# Altium schematic sheet Sheet2.SchDoc
size A4; SheetNumber: 2; SheetTotal: 2
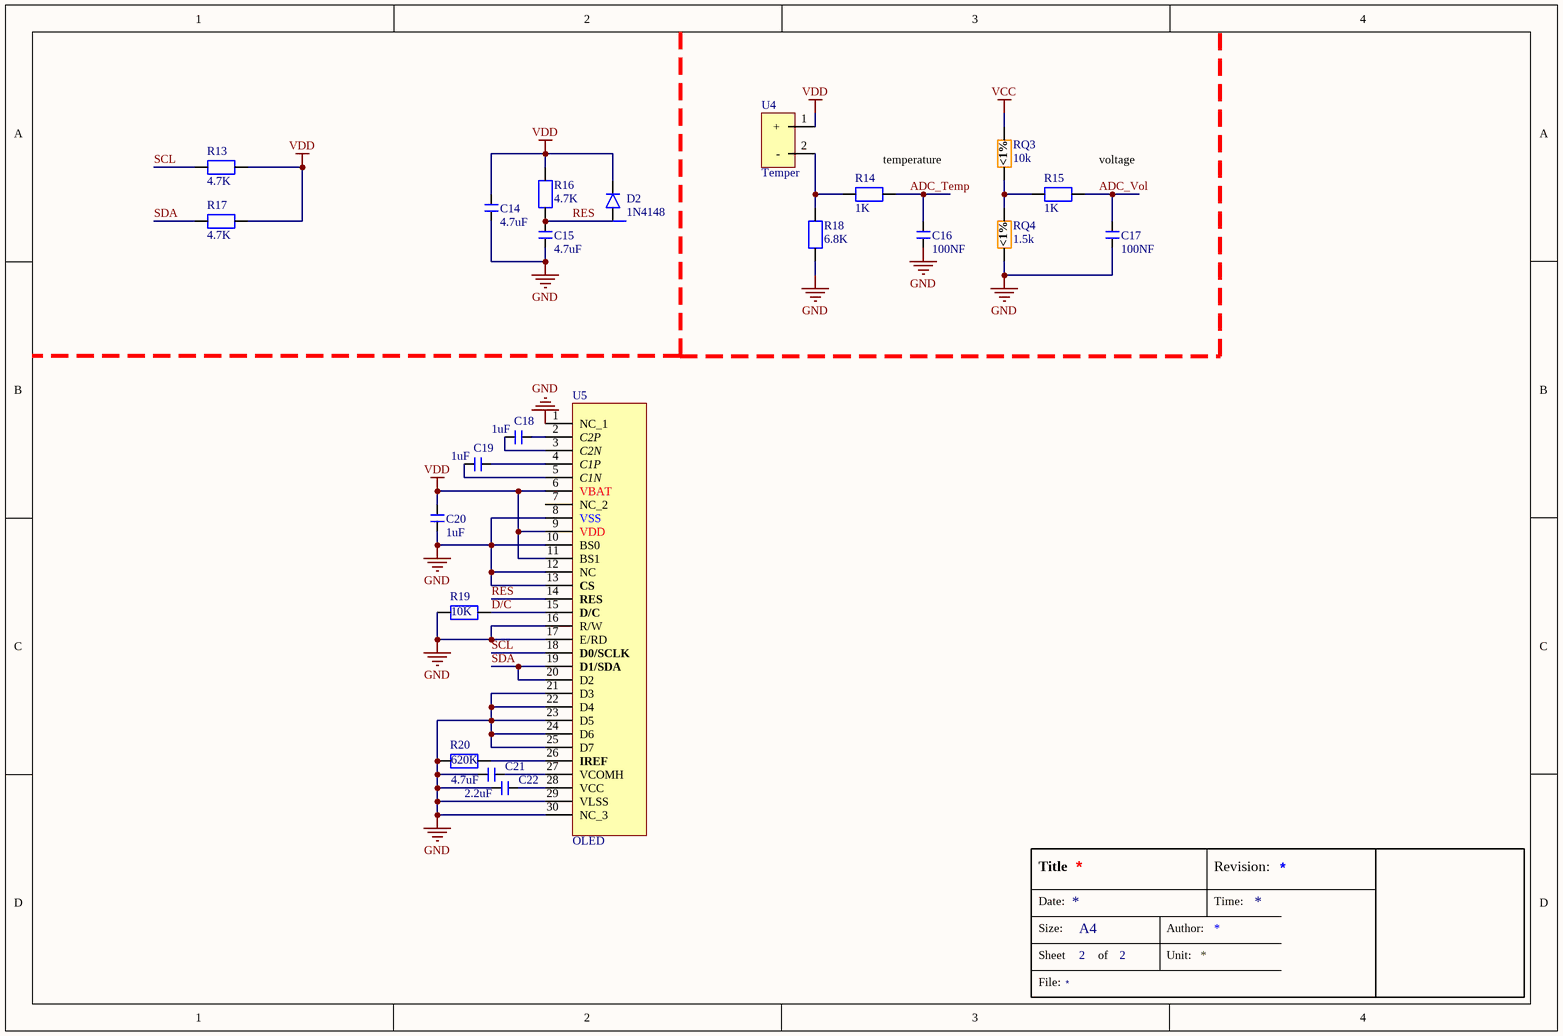
[diagram p0: Sheet2.SchDoc]

## Parts
C14  4.7uF  [CAP_0603]
C15  4.7uF  [CAP_0603]
C16  100NF  [CAP_0603]
C17  100NF  [CAP_0603]
C18  1uF  [CAP_0603]
C19  1uF  [CAP_0603]
C20  1uF  [CAP_0603]
C21  4.7uF  [CAP_0603]
C22  2.2uF  [CAP_0603]
D2  1N4148  [DIODE_SOD123]
R13  4.7K  [RESC_0603_2]
R14  1K  [RESC_0603_2]
R15  1K  [RESC_0603_2]
R16  4.7K  [RESC_0603_2]
R17  4.7K  [RESC_0603_2]
R18  6.8K  [RESC_0603_2]
R19  10K  [RESC_0603_2]
R20  620K  [RESC_0603_2]
RQ3  10k  [RESC_0603_2]
RQ4  1.5k  [RESC_0603_2]
U4  Temper  [RESC_0603_1]
U5  OLED  [OLED_0.96]

## Nets
GND: C14.1 C15.1 C16.1 C17.1 C20.2 C21.2 C22.2 R18.2 R19.2 R20.2 RQ4.1 U5.1(NC_1) U5.8(VSS) U5.10(BS0) U5.12(NC) U5.13(CS) U5.16(R/W) U5.17(E/RD) U5.21(D3) U5.22(D4) U5.23(D5) U5.24(D6) U5.25(D7) U5.29(VLSS) U5.30(NC_3)
VCC: RQ3.2
VDD: C14.2 C20.1 D2.2(N) R13.1 R16.2 R17.1 U4.1(+) U5.6(VBAT) U5.9(VDD) U5.11(BS1)
ADC_Temp: C16.2 R14.2
ADC_Vol: C17.2 R15.2
D/C: R19.1 U5.15(D/C)
RES: C15.2 D2.1(P) R16.1 U5.14(RES)
SCL: R13.2 U5.18(D0/SCLK)
SDA: R17.2 U5.19(D1/SDA) U5.20(D2)
NetC18_1: C18.1 U5.2(C2P)
NetC18_2: C18.2 U5.3(C2N)
NetC19_1: C19.1 U5.4(C1P)
NetC19_2: C19.2 U5.5(C1N)
NetC21_1: C21.1 U5.27(VCOMH)
NetC22_1: C22.1 U5.28(VCC)
NetR14_1: R14.1 R18.1 U4.2(-)
NetR15_1: R15.1 RQ3.1 RQ4.2
NetR20_1: R20.1 U5.26(IREF)

Not connected (* = marked no-connect by the designer): U5 7(NC_2)

## Notes on the sheet
- (near R14) temperature
- (near R15) voltage
- Title
- Date:
- Revision:
- Time:
- File:
- Size:
- Sheet
- A4
- of
- Author:
- Unit:
- (in symbol RES_quality) <1%

## Library data of the parts
C14-C22 = CAP: CAP  12~50V
D2 = Diode-SM: Diode_肖特基/二极管
R13-R20 = RES: RES 贴片
RQ3 RQ4 = RES_quality: RES
U4 = Temper: Mode
U5 = OLED_0.96: SHOW